# EAGLE schematic clockWiring (EAGLE 9.6.2)
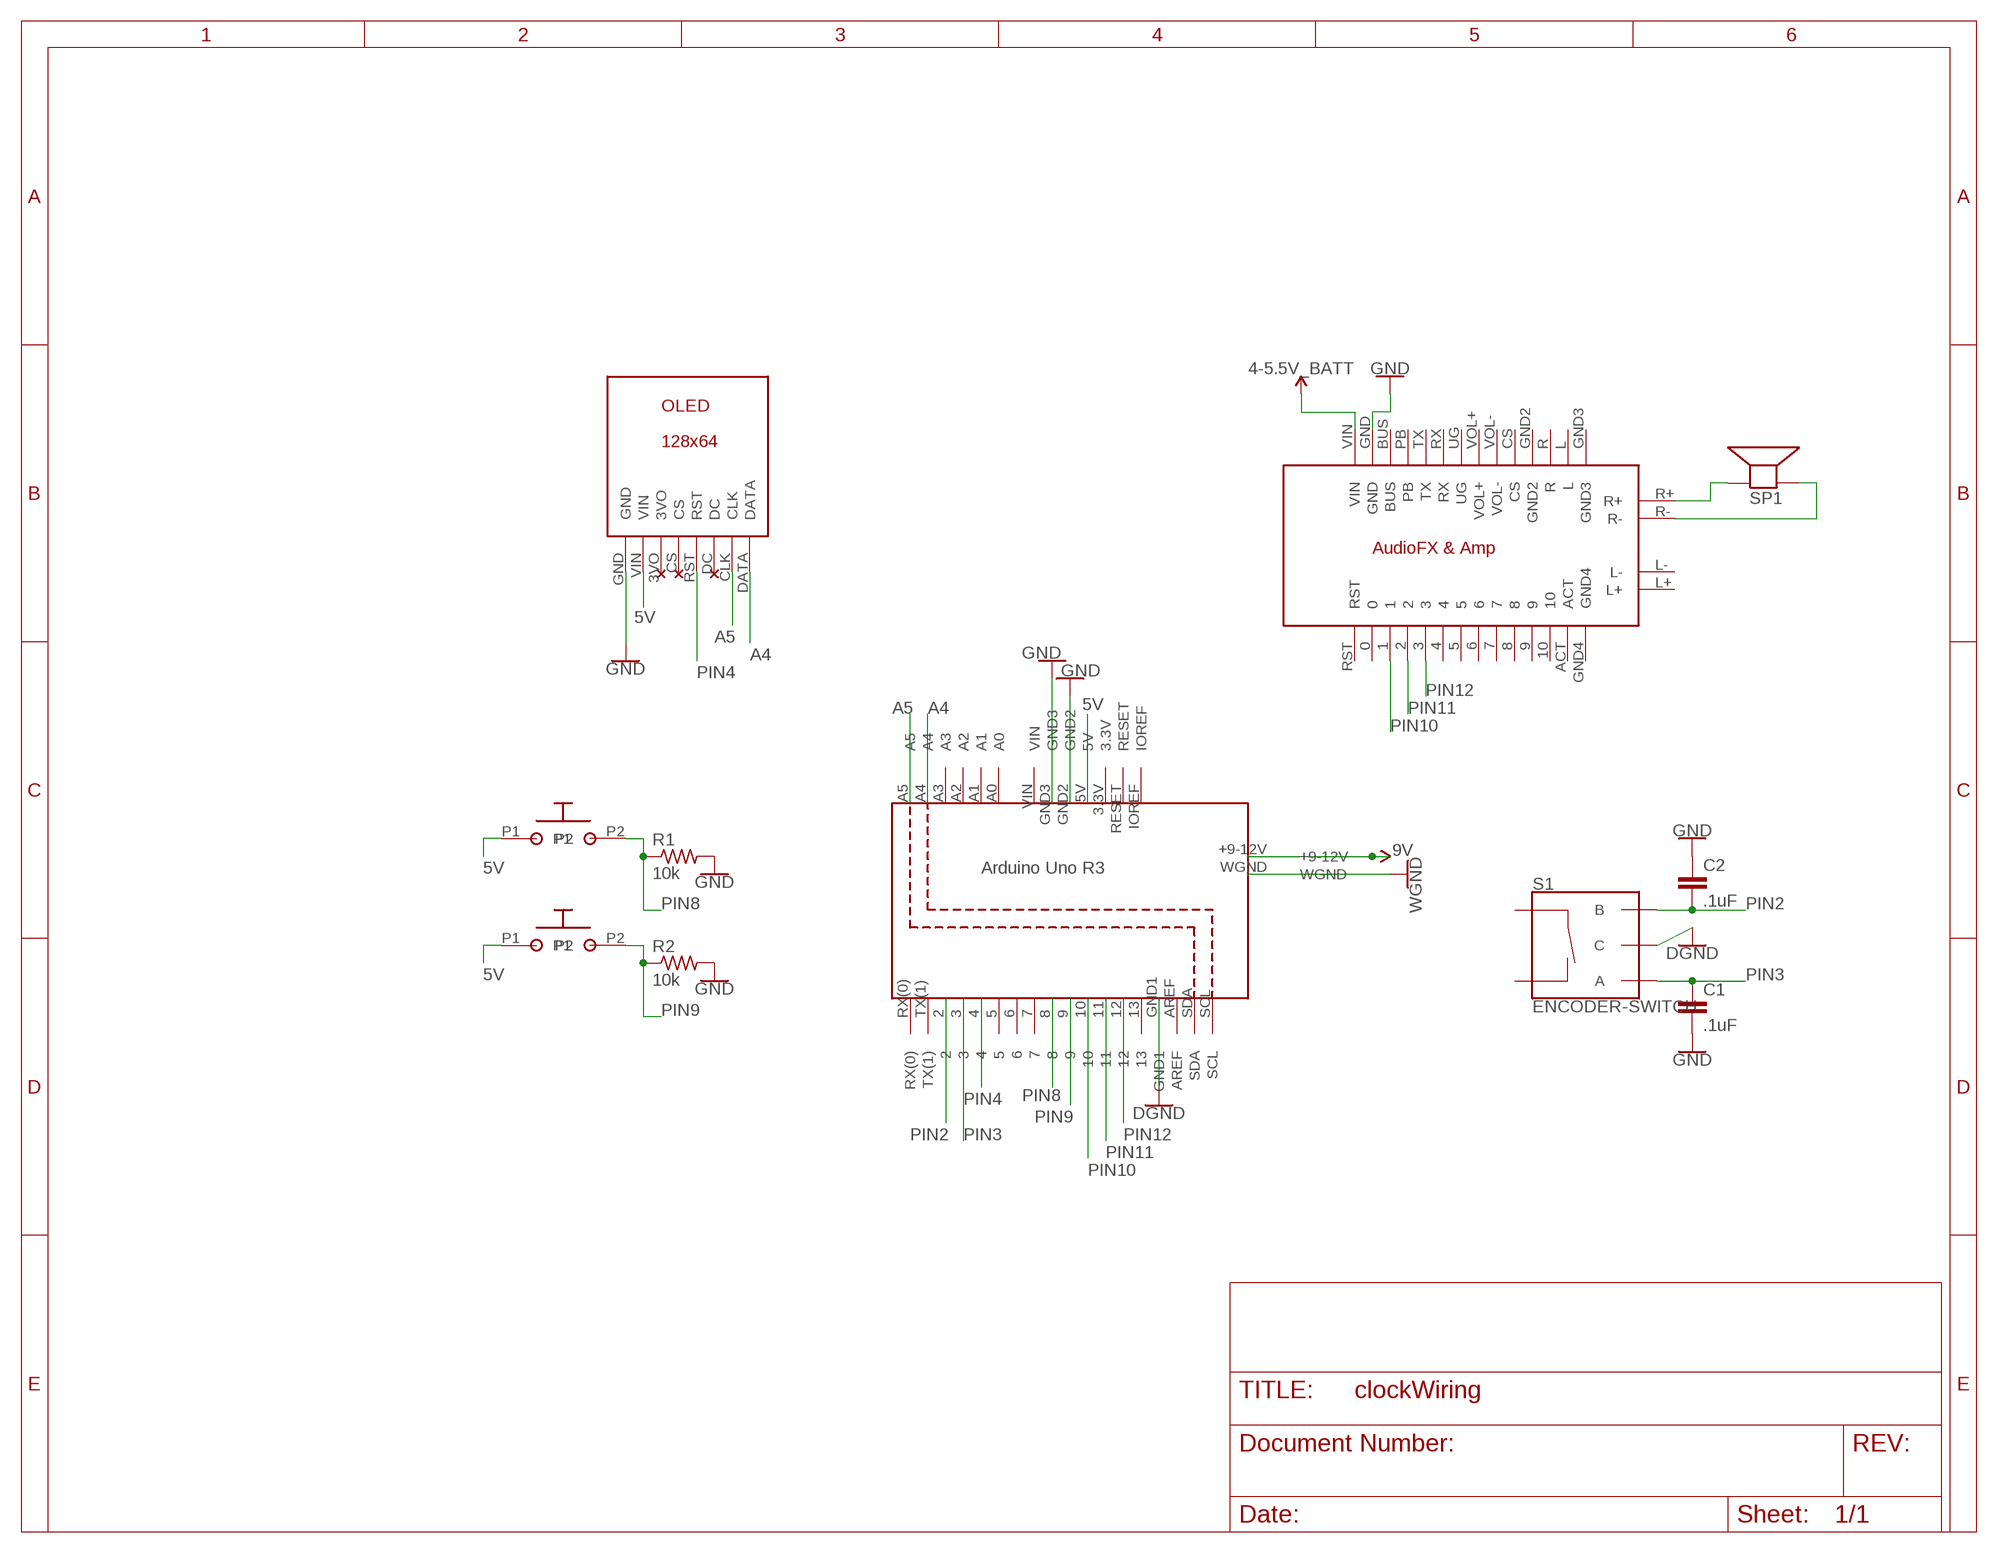
[diagram p0: schematic, sheet 1]

## Parts
C1  .1uF  C2.5/2  [C2.5-2]
C2  .1uF  C2.5/2  [C2.5-2]
R1  10k  FLIPFLOP-RES  [0805-THM]
R2  10k  FLIPFLOP-RES  [0805-THM]
S1  ENCODER-SWITCH  [ROTARY_ENC_PLAIN]
SP1  SPEAKER/PS12  [PS12]
U$2  OLED_128X64  [OLED_128X64]
U$5  AUDIOFX&AMP  [AUDIOFX&AMP]
U$6  ARDUINO_UNO  [ARDUINO_UNO]
U$7  TWOPINBUTTON  [TWOPINBUTTON]
U$8  TWOPINBUTTON  [TWOPINBUTTON]

## Nets
5V: U$2.VIN U$6.5V U$7.P1 U$8.P1
12V: U$6.+9-12V ; supply symbol labelled 9V
A4: U$2.DATA U$6.A4
A5: U$2.CLK U$6.A5
GND: C1.2 C2.1 R1.2 R2.2 S1.C U$2.GND U$5.GND U$6.GND1 U$6.GND2 U$6.GND3 U$6.WGND ; supply symbol labelled DGND, WGND
N$3: SP1.P$2(-) U$5.R-
N$4: SP1.P$1(+) U$5.R+
PIN2: C2.2 S1.B U$6.2
PIN3: C1.1 S1.A U$6.3
PIN4: U$2.RST U$6.4
PIN8: R1.1 U$6.8 U$7.P2
PIN9: R2.1 U$6.9 U$8.P2
PIN10: U$5.1 U$6.10
PIN11: U$5.2 U$6.11
PIN12: U$5.3 U$6.12
V_BATT: U$5.VIN ; supply symbol labelled 4-5.5V_BATT
Unconnected: S1.SW+ S1.SW- U$2.3VO U$2.CS U$2.DC U$5.0 U$5.4 U$5.5 U$5.6 U$5.7 U$5.8 U$5.9 U$5.10 U$5.ACT U$5.BUS U$5.CS U$5.GND2 U$5.GND3 U$5.GND4 U$5.L U$5.L+ U$5.L- U$5.PB U$5.R U$5.RST U$5.RX U$5.TX U$5.UG U$5.VOL+ U$5.VOL- U$6.3.3V U$6.5 U$6.6 U$6.7 U$6.13 U$6.A0 U$6.A1 U$6.A2 U$6.A3 U$6.AREF U$6.IOREF U$6.RESET U$6.RX(0) U$6.SCL U$6.SDA U$6.TX(1) U$6.VIN

## Library data of the parts
C1 C2 = capacitor-wima:C: CAPACITOR naming: grid - package width
R1 R2 = adafruit:FLIPFLOP-RES: Flip Flop resistor An 0805 resistor inside a standard 1/4W 5% resistor. Makes for easy mods
S1 = SparkFun-Switches:ENCODER-SWITCH: Rotary Encoder w/ Select Switch Encoders rotate similarly to potentiometers, but they’re different from potentiometers in that an encoder has full rotation without limits. They output gray code so that you can tell how much and in which direction the encoder has been turned. This encoder includes a push-down select switch built into the shaft. SparkFun Products Rotary Encoder <https://www.sparkfun.com/products/9117> (COM-09117); SF_SKU: COM-09117
SP1 = adafruit:SPEAKER: SPEAKER Source: Buerklin Added PS12 (for part # PS1240 piezo) http://www.ladyada.net/library/pcb/eaglelibrary.html
U$2 = OLED_128x64:OLED_128X64
U$5 = audioFX&Amp:AUDIOFX&AMP
U$6 = ArduinoUno:ARDUINO_UNO
U$7 U$8 = two_pin_button:TWOPINBUTTON